# Altium project MongoosMini.PrjPcb
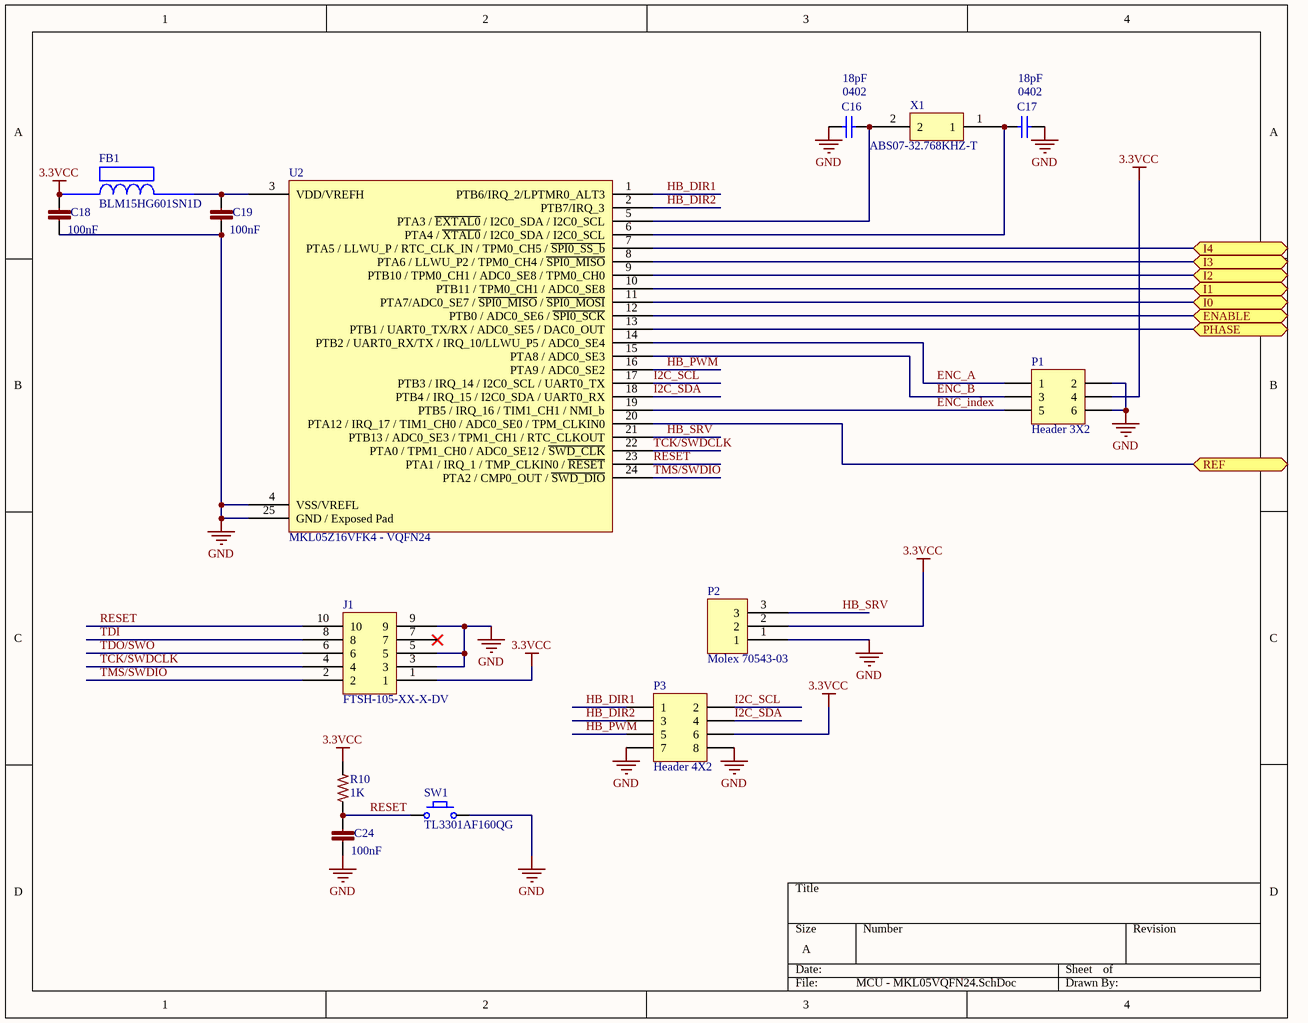
[diagram p0: MCU - MKL05VQFN24.SchDoc]
3 sheets, 51 parts. Net scope: flat (ports and power ports of the same name join across sheets).
Board file: MongooseMini.PcbDoc
Sheets:
  MCU - MKL05VQFN24.SchDoc
  Power.SchDoc
  H-Bridge - DRV8829.SchDoc

## Sheet MCU - MKL05VQFN24.SchDoc
size A

### Parts
C16  0402  value 18pF  [C0402]
C17  0402  value 18pF  [C0402]
C18  100nF  [C0402]
C19  100nF  [C0402]
C24  100nF  [C0402]
FB1  BLM15HG601SN1D  [BLM18PG121SN1D]
J1  FTSH-105-XX-X-DV  [FTSH-105-XX-X-DV]
P1  Header 3X2  [HDR2X3 Shrouded - Molex 0901301106]
P2  Molex 70543-03  [70543-03]
P3  Header 4X2  [HDR2X4 Shrouded]
R10  1K  [R0603]
SW1  TL3301AF160QG  [TL3301AF160QG]
U2  MKL05Z16VFK4 - VQFN24  [98ASA00474D]
X1  ABS07-32.768KHZ-T  [ABS07-32.768KHZ-T]

### Ports
ENABLE, I0, I1, I2, I3, I4, PHASE, REF

### Nets
3.3VCC: C18.1 FB1.1 J1.1 P1.4 P2.2 P3.6 R10.2
GND: C16.2 C17.1 C18.2 C19.2 C24.2 J1.3 J1.5 J1.9 P1.2 P1.6 P2.1 P3.7 P3.8 SW1.2 U2.4(VSS/VREFL) U2.25(GND_/_Exposed_Pad)
ENC_A: P1.1 U2.14(PTB2_/_UART0_RX/TX_/_IRQ_10/LLWU_P5_/_ADC0_SE4)
ENC_B: P1.3 U2.15(PTA8_/_ADC0_SE3)
ENC_index: P1.5 U2.19(PTB5_/_IRQ_16_/_TIM1_CH1_/_NMI_b)
HB_DIR1: P3.1 U2.1(PTB6/IRQ_2/LPTMR0_ALT3)
HB_DIR2: P3.3 U2.2(PTB7/IRQ_3)
HB_PWM: P3.5 U2.16(PTA9_/_ADC0_SE2)
HB_SRV: P2.3 U2.21(PTB13_/_ADC0_SE3_/_TPM1_CH1_/_RTC_CLKOUT)
I2C_SCL: P3.2 U2.17(PTB3_/_IRQ_14_/_I2C0_SCL_/_UART0_TX)
I2C_SDA: P3.4 U2.18(PTB4_/_IRQ_15_/_I2C0_SDA_/_UART0_RX)
RESET: C24.1 J1.10 R10.1 SW1.1 U2.23(PTA1_/_IRQ_1_/_TMP_CLKIN0_/_~{RESET})
TCK/SWDCLK: J1.4 U2.22(PTA0_/_TPM1_CH0_/_ADC0_SE12_/_~{SWD_CLK})
TDI: J1.8
TDO/SWO: J1.6
TMS/SWDIO: J1.2 U2.24(PTA2_/_CMP0_OUT_/_~{SWD_DIO})
NetC16_1: C16.1 U2.5(PTA3_/_~{EXTAL0}_/_I2C0_SDA_/_I2C0_SCL) X1.2
NetC17_2: C17.2 U2.6(PTA4_/_~{XTAL0}_/_I2C0_SDA_/_I2C0_SCL) X1.1
NetC19_1: C19.1 FB1.2 U2.3(VDD/VREFH)
NetR8_1: U2.20(PTA12_/_IRQ_17_/_TIM1_CH0_/_ADC0_SE0_/_TPM_CLKIN0) ; port REF
NetU1_20: U2.13(PTB1_/_UART0_TX/RX_/_ADC0_SE5_/_DAC0_OUT) ; port PHASE
NetU1_21: U2.12(PTB0_/_ADC0_SE6_/_~{SPI0_SCK}) ; port ENABLE
NetU1_23: U2.11(PTA7/ADC0_SE7_/_~{SPI0_MISO}_/_~{SPI0_MOSI}) ; port I0
NetU1_24: U2.10(PTB11_/_TPM0_CH1_/_ADC0_SE8) ; port I1
NetU1_25: U2.9(PTB10_/_TPM0_CH1_/_ADC0_SE8_/_TPM0_CH0) ; port I2
NetU1_26: U2.8(PTA6_/_LLWU_P2_/_TPM0_CH4_/_~{SPI0_MISO}) ; port I3
NetU1_27: U2.7(PTA5_/_LLWU_P_/_RTC_CLK_IN_/_TPM0_CH5_/_~{SPI0_SS_b}) ; port I4

Not connected (* = marked no-connect by the designer): J1 7*

### Library data of the parts
C16 C17 = CL05C180GB5NNNC: CAP CER 18PF 50V 2% NP0 0402; Manufacturer: Samsung; Published: 10 - Dec - 2014; LatestRevisionDate: 10 - Dec - 2014; LatestRevisionNote: Ultimachine Footprint Added; Publisher: Ultimachine; Component Type: Chip Capacitor; Manufacture Part #: CL05C180GB5NNNC; Part Description: CAP CER 18PF 50V 2% NP0 0402; Mounting Type: SMT 0402; Datasheet: http://www.samsungsem.com/kr/front/downloadcms.do?path=/kr/support/product-search/mlcc/__icsFiles/afieldfile/2014/11/05&fileName=S_CL05C180GB5NNNC.pdf; Height: 0.25 ± 0.15mm; Tolerance: 2%; Voltage: 50V; PackageReference: 0402
C18 C19 C24 = GRM155R71C104KA88D: CAP CER 0402 100nF 16V 10% X7R; LastRevisionNote: ImportComponents; Published: 23-Apr-2014; Publisher: UltiMachine; LastRevisionDate: 23-Apr-2014; ManufacturerPartNumber: GRM155R71C104KA88D; VALUE: 100nF
J1 = ARM Cortex JTAG-DEBUG Header
P1 = Header 3X2: Header, 3-Pin, Dual row; LatestRevisionDate: 17-Jul-2002; LatestRevisionNote: Re-released for DXP Platform.; Publisher: Altium Limited
P2 = Molex Endstop
P3 = Header 4X2: Header, 4-Pin, Dual row; LatestRevisionDate: 17-Jul-2002; LatestRevisionNote: Re-released for DXP Platform.; Publisher: Altium Limited
R10 = ERJ-3EKF1001V: RES 0603 1K 100mW 1%; LastRevisionNote: ImportComponents; Published: 23-Apr-2014; Publisher: UltiMachine; LastRevisionDate: 23-Apr-2014; ManufacturerPartNumber: ERJ-3EKF1001V; VALUE: 1K
U2 = MKL05Z16VFK4 - 24 Pin VQFN: ARM Cortex M0+
X1 = ABS07-32.768KHZ-T: ABS07-32.768KHZ-T RTC Crystal Oscillator
SW1 = TL3301AF160QG: MFR: *; MFR#: TL3301AF160QG; Type: SMD Momentary Tactile Switch; Height: *

## Sheet Power.SchDoc
size A
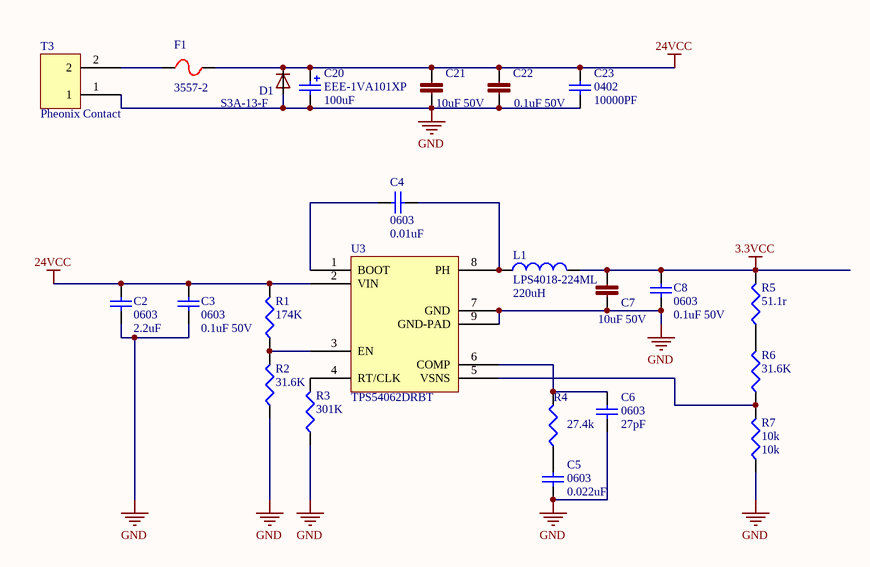
[diagram p1: Power.SchDoc]

### Parts
C2  0603  value 2.2uF  [C0805]
C3  0603  value 0.1uF 50V  [C0603]
C4  0603  value 0.01uF  [C0603]
C5  0603  value 0.022uF  [C0603]
C6  0603  value 27pF  [C0603]
C7  10uF 50V  [C1206]
C8  0603  value 0.1uF 50V  [C0603]
C20  EEE-1VA101XP  value 100uF  [EEE-1VA101XP]
C21  10uF 50V  [C1206]
C22  0.1uF 50V  [C0603]
C23  value 10000PF  [C0402]  (hidden comment: 0402)
D1  S3A-13-F  [DO-214AB]
F1  3557-2  [3557]
L1  LPS4018-224ML  value 220uH  [LPS4018-224ML]
R1  174K  [R0603]
R2  31.6K  [R0603]
R3  301K  [R0603]
R4  27.4k  [R0603]
R5  51.1r  [R0603]
R6  31.6K  [R0603]
R7  10k  [R0603]
T3  Pheonix Contact  [CON-PHEONIX-508-Alt]
U3  TPS54062DRBT  [QFN65P300X300X100_HS-17N]

### Nets
3.3VCC: C7.1 C8.2 L1.2 R5.2
24VCC: C2.2 C3.2 C20.1 C21.1 C22.1 C23.2 D1.C F1.2 R1.2 U3.2(VIN)
GND: C2.1 C3.1 C5.1 C6.1 C7.2 C8.1 C20.2 C21.2 C22.2 C23.1 D1.A R2.1 R3.1 R7.1 T3.1 U3.7(GND) U3.9(GND-PAD)
NetC4_1: C4.1 L1.1 U3.8(PH)
NetC4_2: C4.2 U3.1(BOOT)
NetC5_2: C5.2 R4.1
NetC6_2: C6.2 R4.2 U3.6(COMP)
NetF1_1: F1.1 T3.2
NetR1_1: R1.1 R2.2 U3.3(EN)
NetR3_2: R3.2 U3.4(RT/CLK)
NetR5_1: R5.1 R6.2
NetR6_1: R6.1 R7.2 U3.5(VSNS)

### Library data of the parts
C2 = CL21A225KB9LNNC: CAP CER 2.2UF 50V 10% X5R 0805; MFR: Samsung; Voltage: 50VDC; Published: 10 - Dec - 2014; LatestRevisionDate: April 2015; Component Type: Chip Capacitor; MFR Part #: CL21A225KB9LNNC; Part Description: CAP CER 2.2UF 50V 10% X5R 0805; Mounting Type: SMT 0805; Datasheet: http://www.samsungsem.com/kr/front/downloadcms.do?path=/kr/support/product-search/mlcc/__icsFiles/afieldfile/2014/11/05&fileName=S_CL21A225KB9LNNC.pdf; Height: 1mm; Tolerance: 10%; Digikey #: 1276-2409-1-ND; PackageReference: 0805
C3 C8 = CL10B104KB8SFNC: CAP CER 0.1UF 50V 10% X7R 0603; MFR: Samsung; Voltage: 50VDC; Published: 10 - Dec - 2014; LatestRevisionDate: April 2015; Component Type: Chip Capacitor; MFR Part #: CL10B104KB8SFNC; Part Description: CAP CER 0.1UF 50V 10% X7R 0603; Mounting Type: SMT 0603; Datasheet: http://www.samsungsem.com/kr/front/downloadcms.do?path=/kr/support/product-search/mlcc/__icsFiles/afieldfile/2014/11/05&fileName=S_CL10B104KB8SFNC.pdf; Height: 0.9mm; Tolerance: 10%; Digikey #: 1276-1936-1-ND; PackageReference: 0603
C4 = CL10B103KB8NCNC: CAP CER 10000PF 50V 10% X7R 0603; MFR: Samsung; Voltage: 50VDC; Published: 10 - Dec - 2014; LatestRevisionDate: April 2015; Component Type: Chip Capacitor; MFR Part #: CL10B103KB8NCNC; Part Description: CAP CER 10000PF 50V 10% X7R 0603; Mounting Type: SMT 0603; Datasheet: http://www.samsungsem.com/kr/front/downloadcms.do?path=/kr/support/product-search/mlcc/__icsFiles/afieldfile/2014/11/05&fileName=S_CL10B103KB8NCNC.pdf; Height: 0.9mm; Tolerance: 10%; Digikey #: 1276-1921-1-ND; PackageReference: 0603
C5 = CL10B223JB8NNNC: CAP CER 0.022UF 50V 5% X7R 0603; MFR: Samsung; Tolerance: 10%; Voltage: 50VDC; Published: 10 - Dec - 2014; LatestRevisionDate: April 2015; Component Type: Chip Capacitor; MFR Part #: CL10B223JB8NNNC; Part Description: CAP CER 0.022UF 50V 5% X7R 0603; Mounting Type: SMT 0603; Datasheet: http://www.samsungsem.com/kr/front/downloadcms.do?path=/kr/support/product-search/mlcc/__icsFiles/afieldfile/2014/11/05&fileName=S_CL10B223JB8NNNC.pdf; Height: 0.9mm; Digikey #: 1276-1996-1-ND; PackageReference: 0603
C6 = CL10C270JB8NNNC: CAP CER 27PF 50V 5% NP0 0603; MFR: Samsung; Voltage: 50VDC; Published: 10 - Dec - 2014; LatestRevisionDate: April 2015; Component Type: Chip Capacitor; MFR Part #: CL10C270JB8NNNC; Part Description: CAP CER 27PF 50V 5% NP0 0603; Mounting Type: SMT 0603; Datasheet: http://www.samsungsem.com/kr/front/downloadcms.do?path=/kr/support/product-search/mlcc/__icsFiles/afieldfile/2014/11/05&fileName=S_CL10C270JB8NNNC.pdf; Height: 0.9mm; Tolerance: 5%; Digikey #: 1276-1921-1-ND; PackageReference: 0603
C7 C21 = CL31A106KBHNNNE: CAP CER 10UF 50V 10% X5R 1206; Manufacturer: Samsung; LastRevisionNote: ImportComponents; Published: 25-mar-2015; Publisher: UltiMachine; LastRevisionDate: 25-mar-2015; ManufacturerPartNumber: CL31A106KBHNNNE; VALUE: 10uF 50V
C20 = EEE-1VA101XP: CAP ALUM 100UF 35V 20% SMD; Manufacture: Panasonic; Digikey Part #: PCE3951CT-ND; Price: $0.63; Mount Type: SMT Panasonic VS D Series; Status: Active; Height: 7.70mm; Datasheet: http://industrial.panasonic.com/www-cgi/jvcr13pz.cgi?E+PZ+3+ABA0002+EEE1VA101XP+7+WW; Manufacture Part #: EEE-1VA101XP
C22 = CL10B104KB8SFNC: CAP CER 0.1UF 50V 10% X7R 0603; LastRevisionNote: ImportComponents; Published: 23-Apr-2014; Publisher: UltiMachine; LastRevisionDate: 23-Apr-2014; ManufacturerPartNumber: CL10B104KB8SFNC; VALUE: 0.1uF 50V
C23 = CL05B103JB5NNNC: CAP CER 10000PF 50V 5% X7R 0402; Manufacturer: Samsung; Voltage: 16v; Published: 10 - Dec - 2014; LatestRevisionDate: 10 - Dec - 2014; LatestRevisionNote: Ultimachine Footprint Added; Publisher: Ultimachine; Component Type: Chip Capacitor; Manufacture Part #: CL05B103JB5NNNC; Part Description: CAP CER 10000PF 50V 5% X7R 0402; Mounting Type: SMT 0402; Datasheet: https://www.samsungsem.com/kr/front/downloadcms.do?path=/kr/support/product-search/mlcc/__icsFiles/afieldfile/2014/11/05&fileName=S_CL05B103JB5NNNC.pdf; Height: 0.25 ± 0.15mm; Tolerance: 5%; PackageReference: 0402
D1 = S3A-13-F: DIODE DO-214AB; LastRevisionNote: ImportComponents; Published: 23-Apr-2014; Publisher: UltiMachine; LastRevisionDate: 23-Apr-2014; Value: S3A-13-F
F1 = 3557-2: FUSE PTH ATO; LastRevisionNote: ImportComponents; Published: 23-Apr-2014; Publisher: UltiMachine; LastRevisionDate: 23-Apr-2014; ManufacturerPartNumber: 3557-2
L1 = LPS4018-224ML: Inductor; MFR: Coilcraft; Published: 8-Jun-2000; LatestRevisionDate: April 2015; PackageReference: Coilcraft Custom; Publisher: Altium Limited; PackageDescription: Custom Wound SMD Inductor; MFR#: LPS4018-224ML; Height: 1.7mm
R1 = RC1608F1743CS: RES SMD 174K OHM 1% 1/10W 0603; MFR: Samsung; PackageReference: 0603; MFR #: RC1608F1743CS; Digikey #: 1276-4857-1-ND; PDF: http://www.samsungsem.com/global/support/library/product-catalog/__icsFiles/afieldfile/2015/01/12/CHIP_RESISTOR_150112_1.pdf; Value: 174K
R2 R6 = RC1608F3162CS: RES SMD 31.6K OHM 1% 1/10W 0603; MFR: Samsung; PackageReference: 0603; MFR #: RC1608F3162CS; Digikey #: 1276-4788-1-ND; PDF: http://www.samsungsem.com/global/support/library/product-catalog/__icsFiles/afieldfile/2015/01/12/CHIP_RESISTOR_150112_1.pdf; Value: 31.6K
R3 = RC1608F3013CS: RES SMD 301K OHM 1% 1/10W 0603; MFR: Samsung; PackageReference: 0603; MFR #: RC1608F3013CS; Digikey #: 1276-4881-1-ND; PDF: http://www.samsungsem.com/global/support/library/product-catalog/__icsFiles/afieldfile/2015/01/12/CHIP_RESISTOR_150112_1.pdf; Value: 301K
R4 = RC1608F2742CS: RES SMD 27.4K OHM 1% 1/10W 0603; MFR: Samsung; PackageReference: 0603; MFR #: RC1608F2742CS; Digikey #: 1276-4782-1-ND; PDF: http://www.samsungsem.com/global/support/library/product-catalog/__icsFiles/afieldfile/2015/01/12/CHIP_RESISTOR_150112_1.pdf; Value: 27.4k
R5 = RC1608F51R1CS: RES SMD 51.1 OHM 1% 1/10W 0603; MFR: Samsung; PackageReference: 0603; MFR #: RC1608F51R1CS; Digikey #: 1276-4543-1-ND; PDF: http://www.samsungsem.com/global/support/library/product-catalog/__icsFiles/afieldfile/2015/01/12/CHIP_RESISTOR_150112_1.pdf; Value: 51.1r
R7 = RC1608J103CS: RES SMD 10K OHM 5% 1/10W 0603; MFR: Samsung; PackageReference: 0603; MFR #: RC1608J103CS; Digikey #: 1276-5086-1-ND; PDF: http://www.samsungsem.com/global/support/library/product-catalog/__icsFiles/afieldfile/2015/01/12/CHIP_RESISTOR_150112_1.pdf; Value: 10k
T3 = Pheonix Contact 2X1
U3 = TPS54062DRBT: IC REG BUCK SYNC ADJ 50MA DRBT; MFR: Texas Instruments; MFR#: TPS54062DRBT; Type: DCDC Switching Step Down Regulator IC

## Sheet H-Bridge - DRV8829.SchDoc
size A
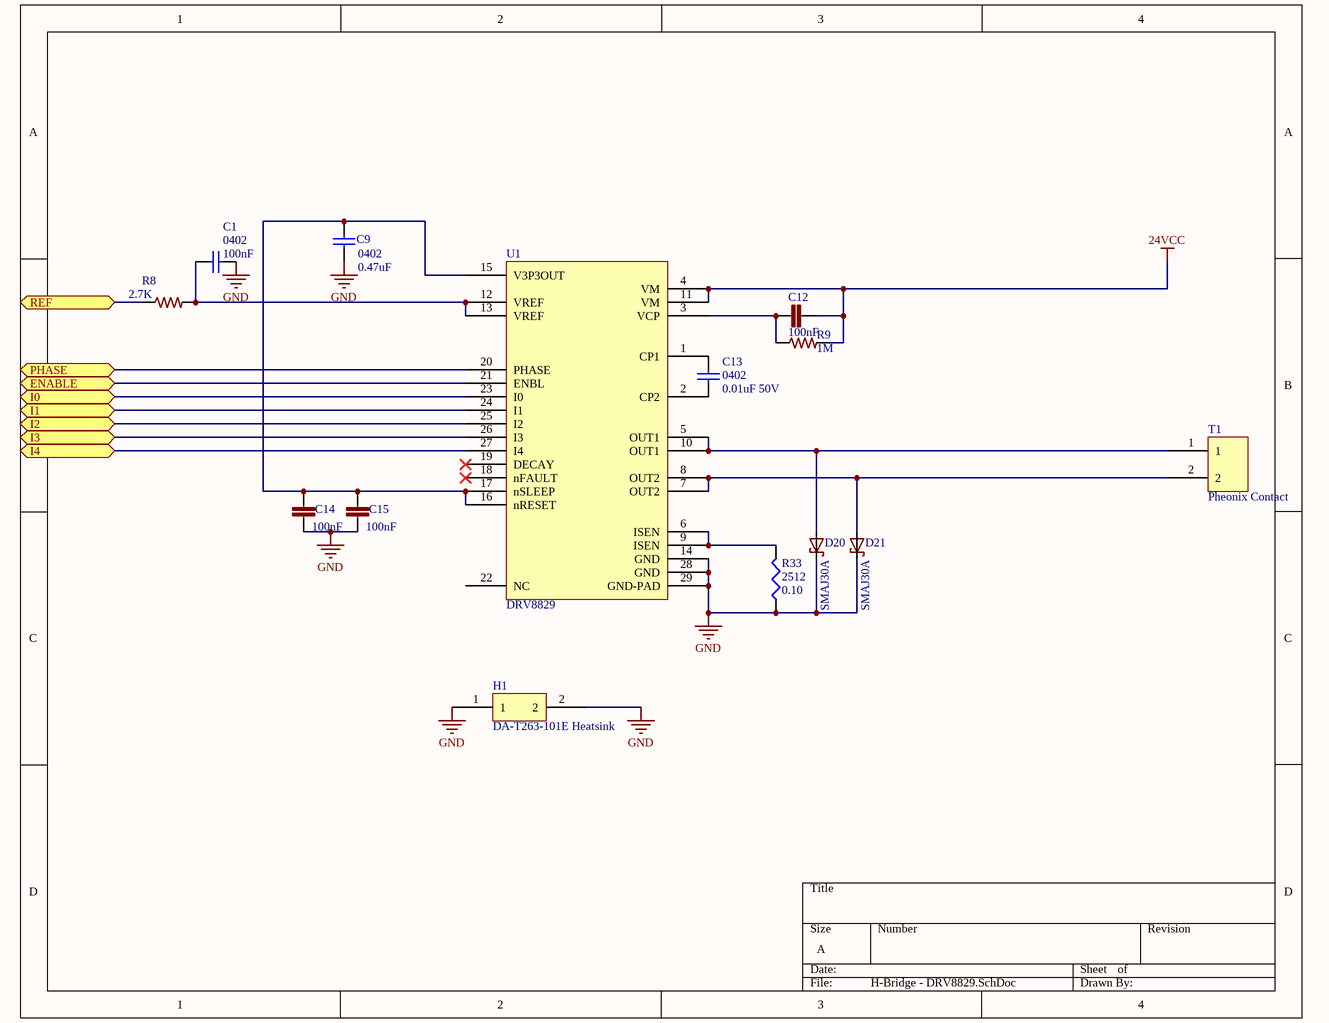
[diagram p2: H-Bridge - DRV8829.SchDoc]

### Parts
C1  value 100nF  [C0402]  (hidden comment: 0402)
C9  value 0.47uF  [C0402]  (hidden comment: 0402)
C12  100nF  [C0603]
C13  value 0.01uF 50V  [C0402]  (hidden comment: 0402)
C14  100nF  [C0402]
C15  100nF  [C0402]
D20  SMAJ30A  [SMA-SM]
D21  SMAJ30A  [SMA-SM]
H1  DA-T263-101E Heatsink  [DA-T263-101E]
R8  2.7K  [R0402]
R9  1M  [R0402]
R33  2512  value 0.10  [2512R-0.55]
T1  Pheonix Contact  [CON-PHEONIX-508-Alt]
U1  DRV8829  [TSSOP28-DRV8829]

### Ports
ENABLE, I0, I1, I2, I3, I4, PHASE, REF

### Nets
24VCC: C12.2 R9.2 U1.4(VM) U1.11(VM)
GND: C1.1 C9.1 C14.2 C15.2 D20.C D21.C H1.1 H1.2 R33.1 U1.14(GND) U1.28(GND) U1.29(GND-PAD)
NetC1_2: C1.2 R8.2 U1.12(VREF) U1.13(VREF)
NetC9_2: C9.2 C14.1 C15.1 U1.15(V3P3OUT) U1.16(nRESET) U1.17(nSLEEP)
NetC12_1: C12.1 R9.1 U1.3(VCP)
NetC13_1: C13.1 U1.2(CP2)
NetC13_2: C13.2 U1.1(CP1)
NetD20_A: D20.A T1.1 U1.5(OUT1) U1.10(OUT1)
NetD21_A: D21.A T1.2 U1.7(OUT2) U1.8(OUT2)
NetR8_1: R8.1 ; port REF
NetR33_2: R33.2 U1.6(ISEN) U1.9(ISEN)
NetU1_20: U1.20(PHASE) ; port PHASE
NetU1_21: U1.21(ENBL) ; port ENABLE
NetU1_23: U1.23(I0) ; port I0
NetU1_24: U1.24(I1) ; port I1
NetU1_25: U1.25(I2) ; port I2
NetU1_26: U1.26(I3) ; port I3
NetU1_27: U1.27(I4) ; port I4

Not connected (* = marked no-connect by the designer): U1 18(nFAULT)* 19(DECAY)* 22(NC)

### Library data of the parts
C1 = 100nF C0402 - GRM155R71C104KA88D: Capacitor (Semiconductor SIM Model); MFR: Murata; Part Description: CAP CER 0.1UF 16V 10% X7R 0402; Tolerance: 10%; Voltage: 16v; Published: 10 - Dec - 2014; LatestRevisionDate: 10 - Dec - 2014; LatestRevisionNote: Ultimachine Footprint Added; Publisher: Ultimachine; Component Type: Chip Capacitor; MFR Part #: GRM155R71C104KA88D; Mounting Type: SMT 0402; Datasheet: http://psearch.murata.com/capacitor/product/GRM155R71C104KA88%23.pdf; Height: 0.5 ±0.05mm; PackageReference: 0402
C9 = GRM155R60J474KE19D: 0.47uF 6.3v C0402 - GRM155R60J474KE19D; MFR: Murata; Part Description: CAP CER 0.47UF 6.3V 10% X5R 0402; Tolerance: 10%; Voltage: 6.3VDC; Published: 10 - Dec - 2014; LatestRevisionDate: 10 - Dec - 2014; LatestRevisionNote: Ultimachine Footprint Added; Publisher: Ultimachine; Component Type: Chip Capacitor; MFR Part #: GRM155R60J474KE19D; Mounting Type: SMT 0402; Datasheet: http://search.murata.co.jp/Ceramy/image/img/A01X/G101/ENG/GRM155R60J474KE19-01.pdf; Height: 0.5 ±0.05mm; PackageReference: 0402
C12 = C0603C104K5RACTU: CAP CER 0603 100nF 50V 10% X7R; LastRevisionNote: ImportComponents; Published: 23-Apr-2014; Publisher: UltiMachine; LastRevisionDate: 23-Apr-2014; ManufacturerPartNumber: C0603C104K5RACTU; VALUE: 100nF
C13 = GRM155R71H103JA88D: CAP CER 10000PF 50V X7R 0402; MFR: Murata; Tolerance: 10%; Voltage: 6.3VDC; Published: 10 - Dec - 2014; LatestRevisionDate: 10 - Dec - 2014; LatestRevisionNote: Ultimachine Footprint Added; Publisher: Ultimachine; Component Type: Chip Capacitor; MFR Part #: GRM155R71H103JA88D; Part Description: CAP CER 10000PF 50V X7R 0402; Mounting Type: SMT 0402; Datasheet: http://search.murata.co.jp/Ceramy/image/img/A01X/G101/ENG/GRM155R71H103JA88-01.pdf; Height: 0.5 ±0.05mm; Digikey #: 490-7763-1-ND; PackageReference: 0402
C14 C15 = GRM155R71C104KA88D: as C18 on sheet MCU - MKL05VQFN24; Published: 23-Apr-2014; Publisher: UltiMachine; LastRevisionDate: 23-Apr-2014; ManufacturerPartNumber: GRM155R71C104KA88D; VALUE: 100nF
D20 D21 = SMAJ30A: DIODE TVS 30V SMA; LastRevisionNote: ImportComponents; Published: 23-Apr-2014; Publisher: UltiMachine; LastRevisionDate: 23-Apr-2014; ManufacturerPartNumber: SMAJ30A
R8 = ERJ-2RKF2701X: RES SMD 2.7K OHM 1% 1/10W 0402; Manufacturer: Panasonic; ManufacturerPartNumber: ERJ2GEJ105X; LastRevisionNote: ImportComponents; Published: 23-Apr-2014; Publisher: Adam; LastRevisionDate: 23-Apr-2014; VALUE: 2.7K
R9 = ERJ2GEJ105X: RES 0402 1M 100mW 5%; LastRevisionNote: ImportComponents; Published: 23-Apr-2014; Publisher: UltiMachine; LastRevisionDate: 23-Apr-2014; ManufacturerPartNumber: ERJ2GEJ105X; VALUE: 1M
R33 = CSRN2512FTR100: RES SMD 0.1 OHM 1% 2W 2512; MFR: Stackpole ELectronics Inc; PackageReference: 2512; MFR #: CSRN2512FTR100; Digikey #: CSRN2512FTR100TR-ND; PDF: http://www.seielect.com/catalog/SEI-CSR_CSRN.pdf
T1 = Pheonix Contact 2X1
U1 = DRV8829: IC MOTOR DRIVER PAR 28HTSSOP; MFR: Texas Instruments; MFR #: DRV8829PWPR; RHos: Yes; Datasheet: https://www.ti.com/lit/ds/symlink/drv8829.pdf; Digikey #: 296-28829-1-ND

## Nets that join several sheets
3.3VCC: MCU - MKL05VQFN24 (7 pins), Power (C7.1 C8.2 L1.2 R5.2)
24VCC: Power (10 pins), H-Bridge - DRV8829 (C12.2 R9.2 U1.4 U1.11)
GND: MCU - MKL05VQFN24 (16 pins), Power (17 pins), H-Bridge - DRV8829 (12 pins)
NetR8_1: MCU - MKL05VQFN24 (U2.20), H-Bridge - DRV8829 (R8.1)
NetU1_20: MCU - MKL05VQFN24 (U2.13), H-Bridge - DRV8829 (U1.20)
NetU1_21: MCU - MKL05VQFN24 (U2.12), H-Bridge - DRV8829 (U1.21)
NetU1_23: MCU - MKL05VQFN24 (U2.11), H-Bridge - DRV8829 (U1.23)
NetU1_24: MCU - MKL05VQFN24 (U2.10), H-Bridge - DRV8829 (U1.24)
NetU1_25: MCU - MKL05VQFN24 (U2.9), H-Bridge - DRV8829 (U1.25)
NetU1_26: MCU - MKL05VQFN24 (U2.8), H-Bridge - DRV8829 (U1.26)
NetU1_27: MCU - MKL05VQFN24 (U2.7), H-Bridge - DRV8829 (U1.27)